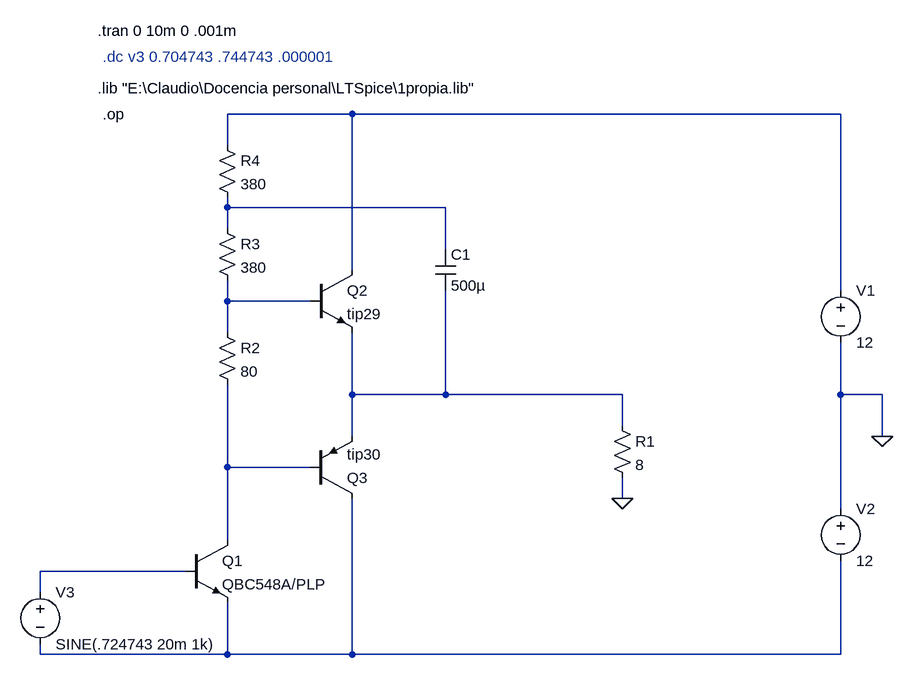
[diagram p0: schematic clase b2 .asc]
clase b2 .asc, the LTspice schematic file:
Version 4
SHEET 1 1572 760
WIRE 736 -80 544 -80
WIRE 1488 -80 736 -80
WIRE 544 -32 544 -80
WIRE 544 64 544 48
WIRE 880 64 544 64
WIRE 544 96 544 64
WIRE 880 128 880 64
WIRE 736 160 736 -80
WIRE 1488 192 1488 -80
WIRE 544 208 544 176
WIRE 672 208 544 208
WIRE 544 256 544 208
WIRE 736 352 736 256
WIRE 880 352 880 192
WIRE 880 352 736 352
WIRE 1152 352 880 352
WIRE 1488 352 1488 272
WIRE 1552 352 1488 352
WIRE 1152 400 1152 352
WIRE 736 416 736 352
WIRE 1552 416 1552 352
WIRE 544 464 544 336
WIRE 672 464 544 464
WIRE 1152 512 1152 480
WIRE 1488 528 1488 352
WIRE 544 576 544 464
WIRE 480 624 256 624
WIRE 256 656 256 624
WIRE 256 752 256 736
WIRE 544 752 544 672
WIRE 544 752 256 752
WIRE 736 752 736 512
WIRE 736 752 544 752
WIRE 1488 752 1488 608
WIRE 1488 752 736 752
FLAG 1152 512 0
FLAG 1552 416 0
DATAFLAG 1024 352 ""
DATAFLAG 608 208 ""
DATAFLAG 592 464 ""
SYMBOL res 1136 384 R0
SYMATTR InstName R1
SYMATTR Value 8
SYMBOL npn 480 576 R0
SYMATTR InstName Q1
SYMATTR Value QBC548A/PLP
SYMBOL voltage 1488 176 R0
WINDOW 123 0 0 Left 0
WINDOW 39 0 0 Left 0
SYMATTR InstName V1
SYMATTR Value 12
SYMBOL voltage 1488 512 R0
WINDOW 123 0 0 Left 0
WINDOW 39 0 0 Left 0
SYMATTR InstName V2
SYMATTR Value 12
SYMBOL res 528 240 R0
SYMATTR InstName R2
SYMATTR Value 80
SYMBOL voltage 256 640 R0
WINDOW 123 0 0 Left 0
WINDOW 39 0 0 Left 0
SYMATTR InstName V3
SYMATTR Value SINE(.724743 20m 1k)
SYMBOL npn 672 160 R0
SYMATTR InstName Q2
SYMATTR Value tip29
SYMBOL pnp 672 512 M180
SYMATTR InstName Q3
SYMATTR Value tip30
SYMBOL res 528 80 R0
SYMATTR InstName R3
SYMATTR Value 380
SYMBOL res 528 -48 R0
SYMATTR InstName R4
SYMATTR Value 380
SYMBOL cap 864 128 R0
SYMATTR InstName C1
SYMATTR Value 500µ
TEXT 344 -120 Left 2 !.lib "E:\\Claudio\\Docencia personal\\LTSpice\\1propia.lib"
TEXT 352 -80 Left 2 !.op
TEXT 352 -168 Left 2 ;.dc v3 0.704743 .744743 .000001
TEXT 344 -208 Left 2 !.tran 0 10m 0 .001m

The netlist it stands for:
* clase b2 .asc
R1 N004 0 8
Q1 N005 N006 N007 0 QBC548A/PLP
V1 N001 0 12
V2 0 N007 12
R2 N003 N005 80
V3 N006 N007 SINE(.724743 20m 1k)
Q2 N001 N003 N004 0 tip29
Q3 N007 N005 N004 0 tip30
R3 N002 N003 380
R4 N001 N002 380
C1 N002 N004 500µ
.model NPN NPN
.model PNP PNP
.lib standard.bjt
.lib "E:\Claudio\Docencia personal\LTSpice\1propia.lib"
.op
* .dc v3 0.704743 .744743 .000001
.tran 0 10m 0 .001m
.backanno
.end